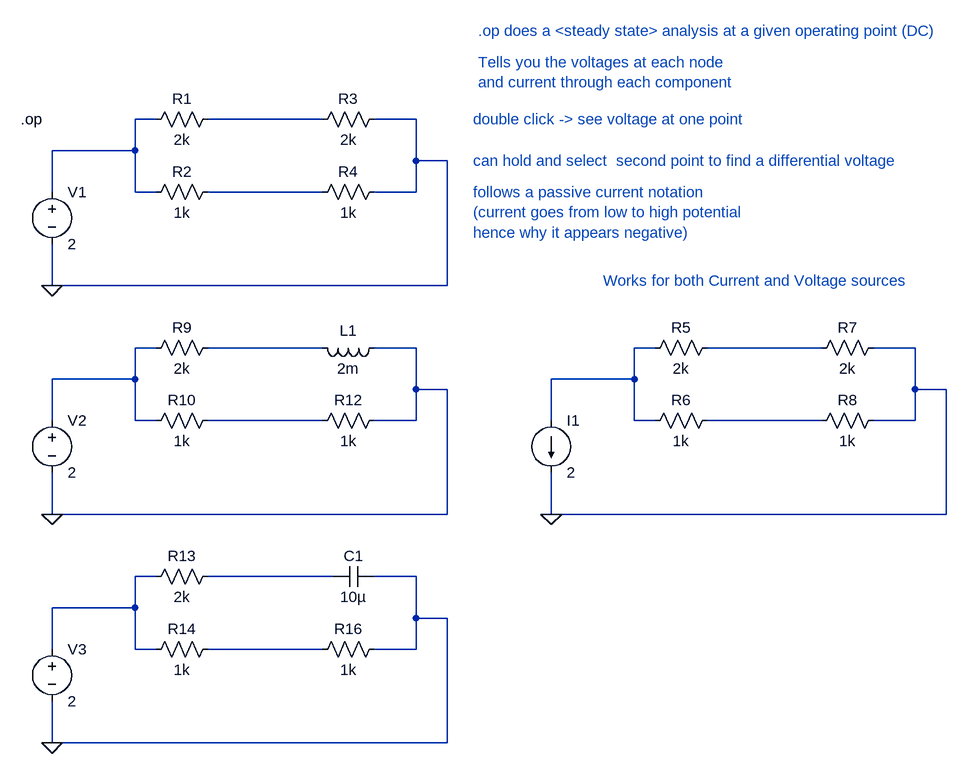
[diagram p0: schematic LTSPICE_Lesson3_OP.asc]
LTSPICE_Lesson3_OP.asc, the LTspice schematic file:
Version 4
SHEET 1 1272 1108
WIRE -688 16 -720 16
WIRE -432 16 -608 16
WIRE -288 16 -352 16
WIRE -720 64 -720 16
WIRE -720 64 -848 64
WIRE -288 80 -288 16
WIRE -240 80 -288 80
WIRE -848 128 -848 64
WIRE -720 128 -720 64
WIRE -688 128 -720 128
WIRE -432 128 -608 128
WIRE -288 128 -288 80
WIRE -288 128 -352 128
WIRE -848 272 -848 208
WIRE -240 272 -240 80
WIRE -240 272 -848 272
WIRE -688 368 -720 368
WIRE -432 368 -608 368
WIRE -288 368 -352 368
WIRE 80 368 48 368
WIRE 336 368 160 368
WIRE 480 368 416 368
WIRE -720 416 -720 368
WIRE -720 416 -848 416
WIRE 48 416 48 368
WIRE 48 416 -80 416
WIRE -288 432 -288 368
WIRE -240 432 -288 432
WIRE 480 432 480 368
WIRE 528 432 480 432
WIRE -848 480 -848 416
WIRE -720 480 -720 416
WIRE -688 480 -720 480
WIRE -432 480 -608 480
WIRE -288 480 -288 432
WIRE -288 480 -352 480
WIRE -80 480 -80 416
WIRE 48 480 48 416
WIRE 80 480 48 480
WIRE 336 480 160 480
WIRE 480 480 480 432
WIRE 480 480 416 480
WIRE -848 624 -848 560
WIRE -240 624 -240 432
WIRE -240 624 -848 624
WIRE -80 624 -80 560
WIRE 528 624 528 432
WIRE 528 624 -80 624
WIRE -688 720 -720 720
WIRE -416 720 -608 720
WIRE -288 720 -352 720
WIRE -720 768 -720 720
WIRE -720 768 -848 768
WIRE -288 784 -288 720
WIRE -240 784 -288 784
WIRE -848 832 -848 768
WIRE -720 832 -720 768
WIRE -688 832 -720 832
WIRE -432 832 -608 832
WIRE -288 832 -288 784
WIRE -288 832 -352 832
WIRE -848 976 -848 912
WIRE -240 976 -240 784
WIRE -240 976 -848 976
FLAG -848 272 0
FLAG -80 624 0
FLAG -848 624 0
FLAG -848 976 0
DATAFLAG -512 16 "$-V(N003)"
DATAFLAG 304 368 "$-V(N006)"
DATAFLAG 0 416 ""
DATAFLAG 512 432 ""
DATAFLAG 256 480 ""
DATAFLAG 192 368 ""
DATAFLAG -512 368 "$-V(N003)"
DATAFLAG -512 720 "$-V(N003)"
SYMBOL voltage -848 112 R0
WINDOW 123 0 0 Left 0
WINDOW 39 0 0 Left 0
SYMATTR InstName V1
SYMATTR Value 2
SYMBOL res -592 0 R90
WINDOW 0 0 56 VBottom 2
WINDOW 3 32 56 VTop 2
SYMATTR InstName R1
SYMATTR Value 2k
SYMBOL res -592 112 R90
WINDOW 0 0 56 VBottom 2
WINDOW 3 32 56 VTop 2
SYMATTR InstName R2
SYMATTR Value 1k
SYMBOL res -336 0 R90
WINDOW 0 0 56 VBottom 2
WINDOW 3 32 56 VTop 2
SYMATTR InstName R3
SYMATTR Value 2k
SYMBOL res -336 112 R90
WINDOW 0 0 56 VBottom 2
WINDOW 3 32 56 VTop 2
SYMATTR InstName R4
SYMATTR Value 1k
SYMBOL res 176 352 R90
WINDOW 0 0 56 VBottom 2
WINDOW 3 32 56 VTop 2
SYMATTR InstName R5
SYMATTR Value 2k
SYMBOL res 176 464 R90
WINDOW 0 0 56 VBottom 2
WINDOW 3 32 56 VTop 2
SYMATTR InstName R6
SYMATTR Value 1k
SYMBOL res 432 464 R90
WINDOW 0 0 56 VBottom 2
WINDOW 3 32 56 VTop 2
SYMATTR InstName R8
SYMATTR Value 1k
SYMBOL current -80 480 R0
WINDOW 123 0 0 Left 0
WINDOW 39 0 0 Left 0
SYMATTR InstName I1
SYMATTR Value 2
SYMBOL res 432 352 R90
WINDOW 0 0 56 VBottom 2
WINDOW 3 32 56 VTop 2
SYMATTR InstName R7
SYMATTR Value 2k
SYMBOL voltage -848 464 R0
WINDOW 123 0 0 Left 0
WINDOW 39 0 0 Left 0
SYMATTR InstName V2
SYMATTR Value 2
SYMBOL res -592 352 R90
WINDOW 0 0 56 VBottom 2
WINDOW 3 32 56 VTop 2
SYMATTR InstName R9
SYMATTR Value 2k
SYMBOL res -592 464 R90
WINDOW 0 0 56 VBottom 2
WINDOW 3 32 56 VTop 2
SYMATTR InstName R10
SYMATTR Value 1k
SYMBOL res -336 464 R90
WINDOW 0 0 56 VBottom 2
WINDOW 3 32 56 VTop 2
SYMATTR InstName R12
SYMATTR Value 1k
SYMBOL voltage -848 816 R0
WINDOW 123 0 0 Left 0
WINDOW 39 0 0 Left 0
SYMATTR InstName V3
SYMATTR Value 2
SYMBOL res -592 704 R90
WINDOW 0 0 56 VBottom 2
WINDOW 3 32 56 VTop 2
SYMATTR InstName R13
SYMATTR Value 2k
SYMBOL res -592 816 R90
WINDOW 0 0 56 VBottom 2
WINDOW 3 32 56 VTop 2
SYMATTR InstName R14
SYMATTR Value 1k
SYMBOL res -336 816 R90
WINDOW 0 0 56 VBottom 2
WINDOW 3 32 56 VTop 2
SYMATTR InstName R16
SYMATTR Value 1k
SYMBOL ind -336 352 R90
WINDOW 0 5 56 VBottom 2
WINDOW 3 32 56 VTop 2
SYMATTR InstName L1
SYMATTR Value 2m
SYMBOL cap -352 704 R90
WINDOW 0 0 32 VBottom 2
WINDOW 3 32 32 VTop 2
SYMATTR InstName C1
SYMATTR Value 10µ
TEXT -192 -120 Left 2 ;.op does a <steady state> analysis at a given operating point (DC)
TEXT 0 264 Left 2 ;Works for both Current and Voltage sources
TEXT -192 -72 Left 2 ;Tells you the voltages at each node\nand current through each component
TEXT -896 16 Left 2 !.op
TEXT -200 16 Left 2 ;double click -> see voltage at one point
TEXT -200 80 Left 2 ;can hold and select  second point to find a differential voltage
TEXT -200 128 Left 2 ;follows a passive current notation \n(current goes from low to high potential\nhence why it appears negative)

The netlist it stands for:
* LTSPICE_Lesson3_OP.asc
V1 N001 0 2
R1 N002 N001 2k
R2 N003 N001 1k
R3 0 N002 2k
R4 0 N003 1k
R5 N007 N006 2k
R6 N009 N006 1k
R8 0 N009 1k
I1 N006 0 2
R7 0 N007 2k
V2 N004 0 2
R9 N005 N004 2k
R10 N008 N004 1k
R12 0 N008 1k
V3 N010 0 2
R13 N011 N010 2k
R14 N012 N010 1k
R16 0 N012 1k
L1 0 N005 2m
C1 0 N011 10µ
* .op does a <steady state> analysis at a given operating point (DC)
* Works for both Current and Voltage sources
* Tells you the voltages at each node
* and current through each component
.op
* double click -> see voltage at one point
* can hold and select  second point to find a differential voltage
* follows a passive current notation
* (current goes from low to high potential
* hence why it appears negative)
.backanno
.end